# EAGLE design button_breakout_v1.0 (EAGLE 9.6.2)
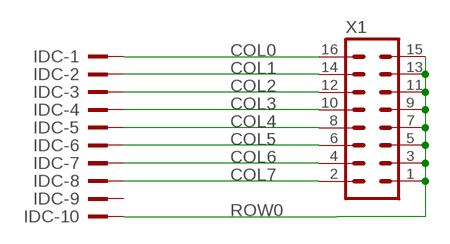
[diagram p0: schematic, sheet 1]

## Parts
IDC  CONN-IDC-10PS  [CONN-IDC10P-S]
X1  MA08-2J  [MA08-2J]

## Nets
COL0: IDC.1 X1.16
COL1: IDC.2 X1.14
COL2: IDC.3 X1.12
COL3: IDC.4 X1.10
COL4: IDC.5 X1.8
COL5: IDC.6 X1.6
COL6: IDC.7 X1.4
COL7: IDC.8 X1.2
ROW0: IDC.10 X1.1 X1.3 X1.5 X1.7 X1.9 X1.11 X1.13 X1.15
Unconnected: IDC.9

## Library data of the parts
IDC = joakim:CONN-IDC-10P: 10P IDC Header
X1 = joakim:MA08-2J: PIN HEADER; OC_FARNELL: unknown; OC_NEWARK: unknown

## Board
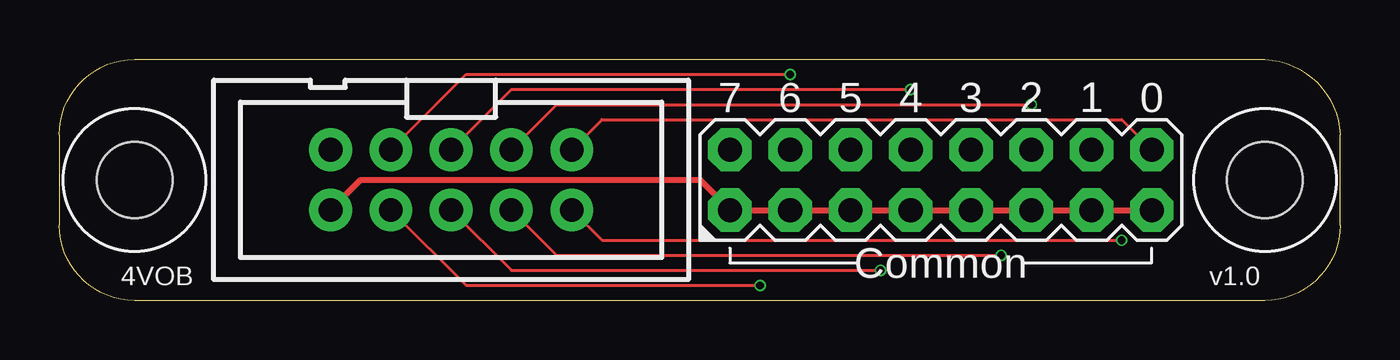
[diagram p1: board, top side]
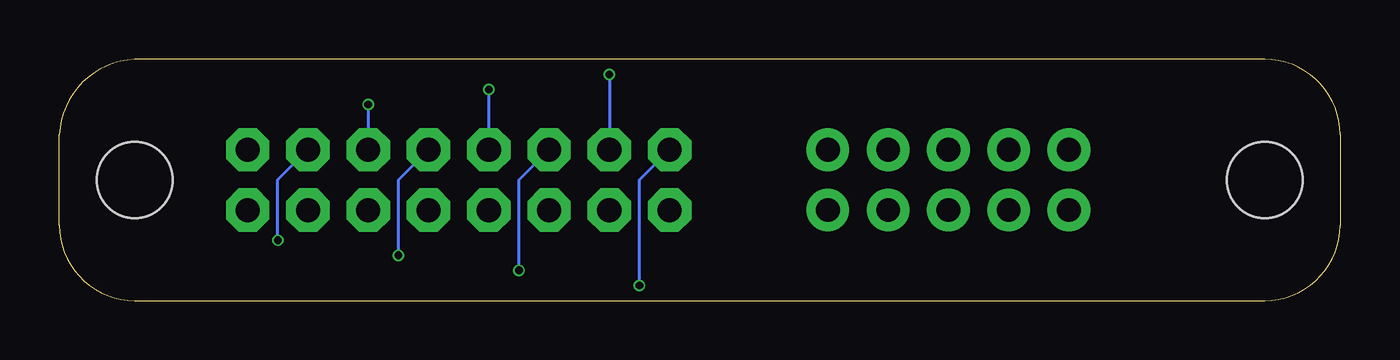
[diagram p2: board, bottom side, seen from below]

Size 53.98 x 10.16 mm. Coordinates in mm from the lower left corner, seen from the top.
Outline: 53.98,3.17 53.98,6.99 arc85 50.8,10.16 3.17,10.16 arc90 0,6.99 0,3.17 arc90 3.17,0 50.8,0 arc90 53.98,3.17
Copper layers (1*16): Top 0.035mm / dielectric 1.6mm / Bottom 0.035mm
Design rules "jlcpcb-2layers": minimum track width 5mil, minimum drill 0.3mm, track to track 5mil, track to pad 5mil, pad to pad 5mil, via to via 5mil, smd to smd 5mil, copper to edge 0.2mm, drill to drill 6mil, minimum pad ring 10mil, minimum via ring 3mil, stop-mask expansion 4mil, vias tented up to drill 0mil, thermal gap 10mil
Holes 3.2 mm at 3.17,5.08 50.8,5.08

### Footprints (pad centres in the part's own frame; a part is rotated, then mirrored left to right if it is on the bottom)
CONN-IDC10P-S = drill 1 pad 1.422: 1 -5.08,-1.27; 2 -5.08,1.27; 3 -2.54,-1.27; 4 -2.54,1.27; 5 0,-1.27; 6 0,1.27; 7 2.54,-1.27; 8 2.54,1.27; 9 5.08,-1.27; 10 5.08,1.27
MA08-2J = drill 1.016 octagon: 1 -8.89,-1.27; 2 -8.89,1.27; 3 -6.35,-1.27; 4 -6.35,1.27; 5 -3.81,-1.27; 6 -3.81,1.27; 7 -1.27,-1.27; 8 -1.27,1.27; 9 1.27,-1.27; 10 1.27,1.27; 11 3.81,-1.27; 12 3.81,1.27; 13 6.35,-1.27; 14 6.35,1.27; 15 8.89,-1.27; 16 8.89,1.27

### Placement (x,y rotation side)
IDC  16.51,5.08 180 top
X1  37.15,5.08 0 top

### Tracks (layer width: path | path; a pad name or v marks a point on that pad's centre or on a via)
COL0
  Top 0.127: IDC.1 22.86,7.62 44.77,7.62 X1.16
COL1  (via drill 0.33)
  Top 0.127: IDC.2 22.86,2.54 v44.77,2.54
  Bottom 0.127: v44.77,2.54 44.77,5.08 X1.14
COL2  (via drill 0.33)
  Top 0.127: IDC.3 20.95,8.26 v40.96,8.26
  Bottom 0.127: v40.96,8.26 X1.12
COL3  (via drill 0.33)
  Top 0.127: IDC.4 20.95,1.91 v39.69,1.91
  Bottom 0.127: v39.69,1.91 39.69,5.08 X1.10
COL4  (via drill 0.33)
  Top 0.127: IDC.5 19.05,8.89 v35.88,8.89
  Bottom 0.127: v35.88,8.89 X1.8
COL5  (via drill 0.33)
  Top 0.127: IDC.6 19.05,1.27 v34.61,1.27
  Bottom 0.127: v34.61,1.27 34.61,5.08 X1.6
COL6  (via drill 0.33)
  Top 0.127: IDC.7 17.14,9.53 v30.8,9.53
  Bottom 0.127: v30.8,9.53 X1.4
COL7  (via drill 0.33)
  Top 0.127: IDC.8 17.14,0.64 v29.53,0.64
  Bottom 0.127: v29.53,0.64 29.53,5.08 X1.2
ROW0
  Top 0.254: IDC.10 12.7,5.08 26.99,5.08 X1.1 X1.3 X1.5 X1.7 X1.9 X1.11 X1.13 X1.15

### Text on the board
tNames: 7 | 6 | 5 | 4 | 3 | 2 | 1 | 0 | 4VOB | Common | v1.0